# EAGLE design EMGrealPart4 (EAGLE 9.4.0)

## Sheet 1 of 2
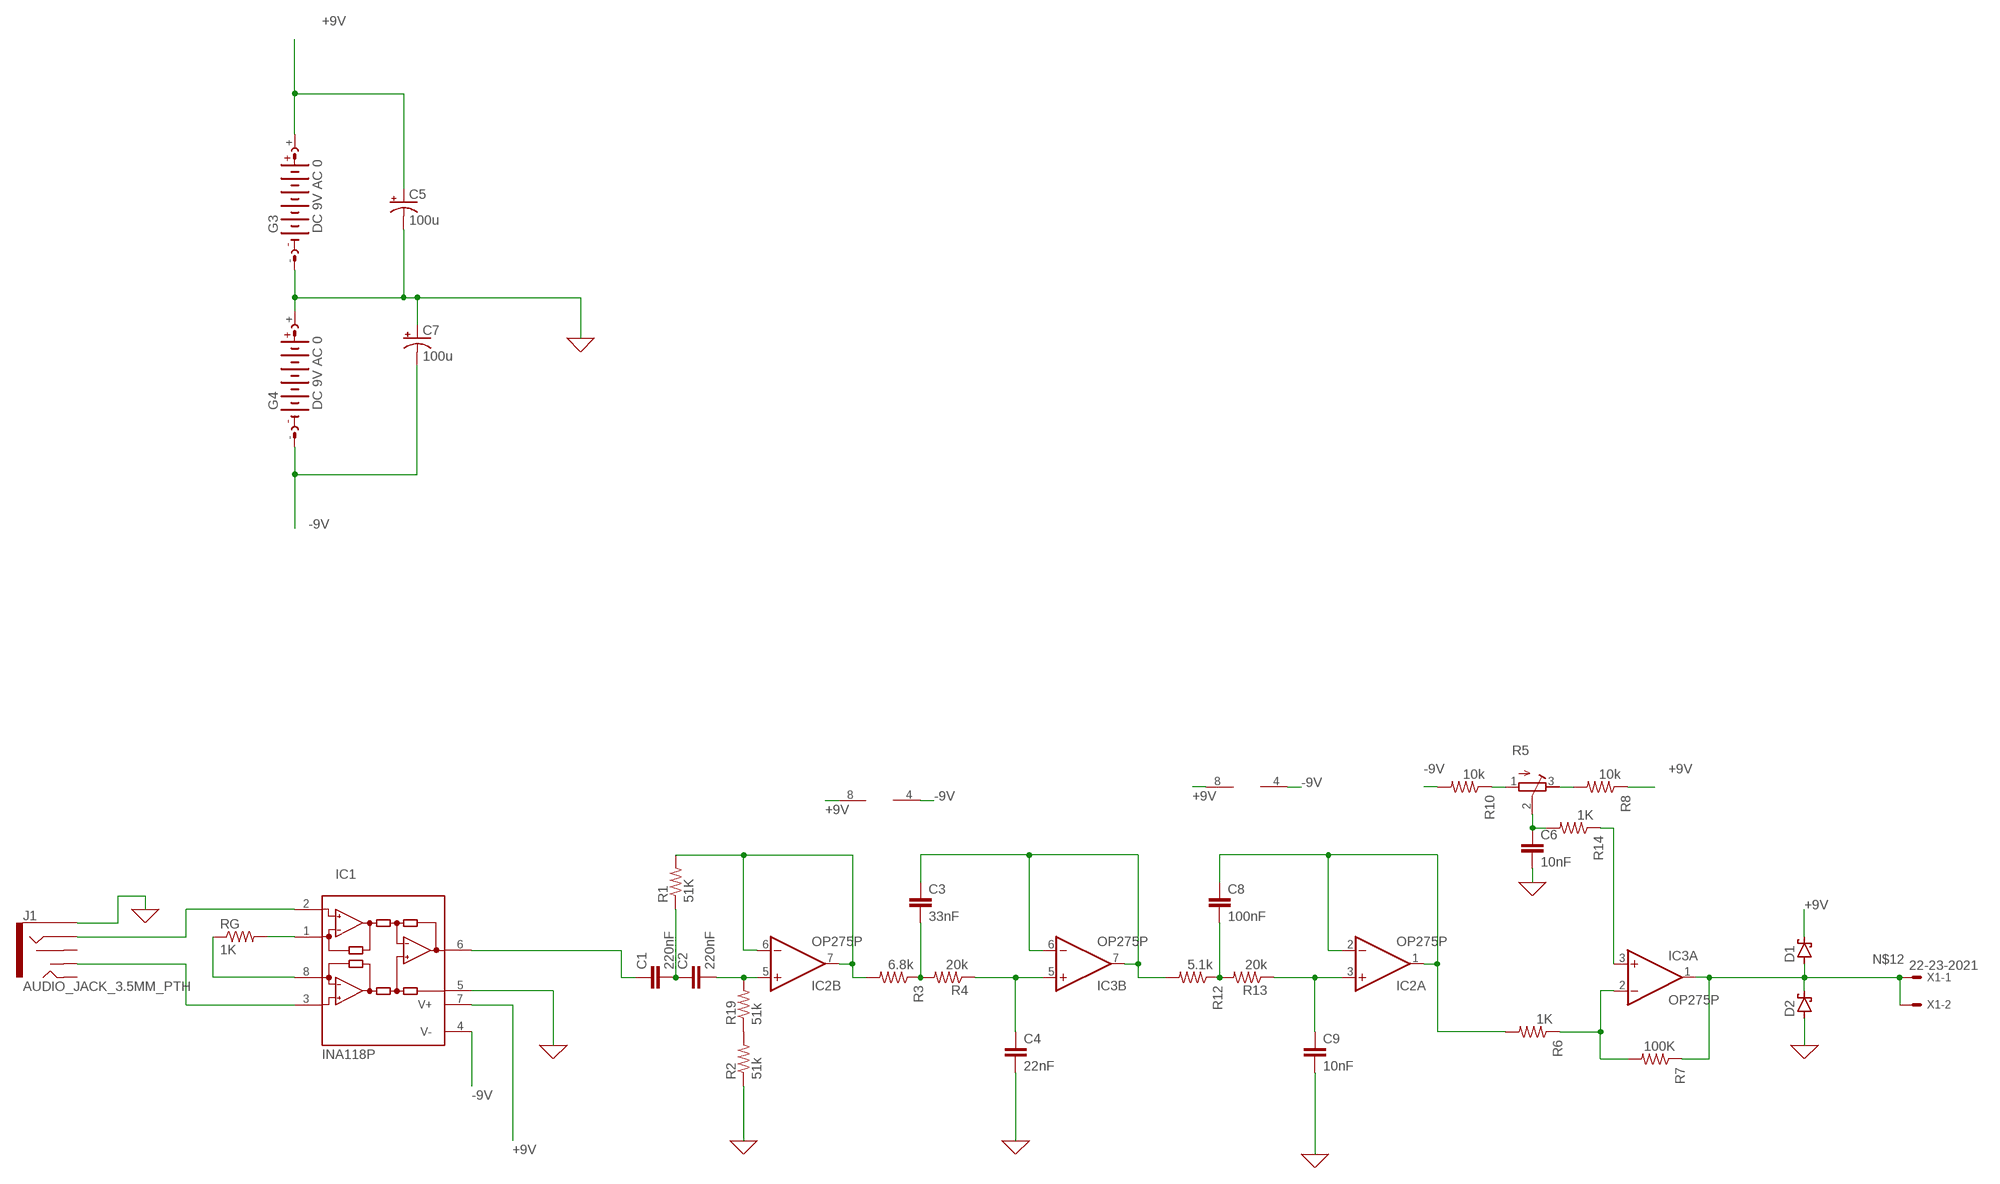
[diagram p0: schematic, sheet 1]

### Parts
C1  220nF  C-EU050-025X075  [C050-025X075]
C2  220nF  C-EU050-025X075  [C050-025X075]
C3  33nF  C-EU050-025X075  [C050-025X075]
C4  22nF  C-EU050-025X075  [C050-025X075]
C5  100u  CPOL-USE2.5-6  [E2,5-6]
C6  10nF  C-EU050-025X075  [C050-025X075]
C7  100u  CPOL-USE2.5-6  [E2,5-6]
C8  100nF  C-EU050-025X075  [C050-025X075]
C9  10nF  C-EU050-025X075  [C050-025X075]
D1  SCHOTTKY-DIODEF126Z12  [F126Z12]
D2  SCHOTTKY-DIODEF126Z12  [F126Z12]
G3  DC 9V AC 0  AB9V  [AB9V]
G4  DC 9V AC 0  AB9V  [AB9V]
IC1  INA118P  [DIL08]
IC2  OP275P  [DIL08]
IC3  OP275P  [DIL08]
J1  AUDIO_JACK_3.5MM_PTH  [AUDIO-JACK]
R1  51K  R-US_0207/12  [0207/12]
R2  51k  R-US_0207/12  [0207/12]
R3  6.8k  R-US_0207/12  [0207/12]
R4  20k  R-US_0207/12  [0207/12]
R5  R-TRIMM64W  [RTRIM64W]
R6  1K  R-US_0207/12  [0207/12]
R7  100K  R-US_0207/12  [0207/12]
R8  10k  R-US_0207/12  [0207/12]
R10  10k  R-US_0207/12  [0207/12]
R12  5.1k  R-US_0207/12  [0207/12]
R13  20k  R-US_0207/12  [0207/12]
R14  1K  R-US_0207/12  [0207/12]
R19  51k  R-US_0207/12  [0207/12]
RG  1K  R-US_0207/12  [0207/12]
X1  22-23-2021  [22-23-2021]

### Nets
0: C4.2 C5.- C6.2 C7.+ C9.2 D2.A G3.- G4.+ IC1.5(REF) J1.SLEEVE R2.1 ; supply symbol labelled GND
+9V: C5.+ D1.C G3.+ IC1.7(V+) IC2.8(P:V+) IC3.8(P:V+) R8.1
-9V: C7.- G4.- IC1.4(V-) IC2.4(P:V-) IC3.4(P:V-) R10.2
N$1: IC1.1(RG) RG.2
N$2: IC1.8(RG) RG.1
N$3: IC1.2(-IN) J1.RING
N$4: C8.2 R12.1 R13.2
N$5: C1.2 C2.1 R1.1
N$6: C1.1 IC1.6(OUT)
N$7: C2.2 IC2.5(B:+IN) R19.2
N$8: IC2.6(B:-IN) IC2.7(B:OUT) R1.2 R3.2
N$9: C3.2 R3.1 R4.2
N$10: C4.1 IC3.5(B:+IN) R4.1
N$11: C3.1 IC3.6(B:-IN) IC3.7(B:OUT) R12.2
N$12: D1.A D2.C IC3.1(A:OUT) R7.1 X1.1 X1.2
N$14: C9.1 IC2.3(A:+IN) R13.1
N$15: R5.1(A) R10.1
N$16: C6.1 R5.2(S) R14.2
N$17: IC3.2(A:-IN) R6.1 R7.2
N$18: R2.2 R19.1
N$19: C8.1 IC2.1(A:OUT) IC2.2(A:-IN) R6.2
N$20: R5.3(E) R8.2
N$25: IC3.3(A:+IN) R14.1
N$26: IC1.3(+IN) J1.TSH
Unconnected: J1.RSH J1.TIP

## Sheet 2 of 2

## Library data of the parts
C1-C4 C6 C8 C9 = rcl:C-EU: CAPACITOR, European symbol; SPICEPREFIX: C
C5 C7 = rcl:CPOL-US: POLARIZED CAPACITOR, American symbol; SPICEPREFIX: C
D1 D2 = diode:SCHOTTKY-DIODE: Schottky Diode
G3 G4 = battery:AB9V: 9-V BATTERY CLIP; SPICEPREFIX: V
IC1 = burr-brown:INA118: Instrumentation Amplifier Precision, Low Power; MF: TEXAS INSTRUMENTS; MPN: INA118P; OC_FARNELL: 1470354; OC_NEWARK: 96K4515; SPICEMODEL: INA118a; SPICEPREFIX: X
IC2 IC3 = linear:OP275: Dual Very Low Noise Precision Operational Amplifier Source: http://www.analog.com/static/imported-files/data_sheets/OP270.pdf; SPICEMODEL: OP275p; SPICEPREFIX: X
J1 = SparkFun-Connectors:AUDIO_JACK_3.5MM: Audio Jack 3.5mm variants of PTH and SMT stereo audio jack with bypass switches. SparkFun Products: SparkFun SparkPunk Sound Kit <[https://www.sparkfun.com/products/11177]> - PTH MP3 Trigger <https://www.sparkfun.com/products/13720> -3.5mm SMD SparkFun PicoBoard <https://www.sparkfun.com/products/11888>- 2.5mm SMD; PROD_ID: CONN-08774; SF_ID: PRT-08032
R1-R4 R6-R8 R10 R12-R14 R19 RG = rcl:R-US_: RESISTOR, American symbol; SPICEPREFIX: R
R5 = rcl:R-TRIMM: Trimm resistor; SPICEMODEL: X; SPICEPREFIXL: POT
X1 = con-molex:22-23-2021: .100" (2.54mm) Center Header - 2 Pin; MF: MOLEX; MPN: 22-23-2021; OC_FARNELL: 1462926; OC_NEWARK: 25C3832

## Module MO
Ports: OUT(io) IN(io)

### Library data of the parts

## Board
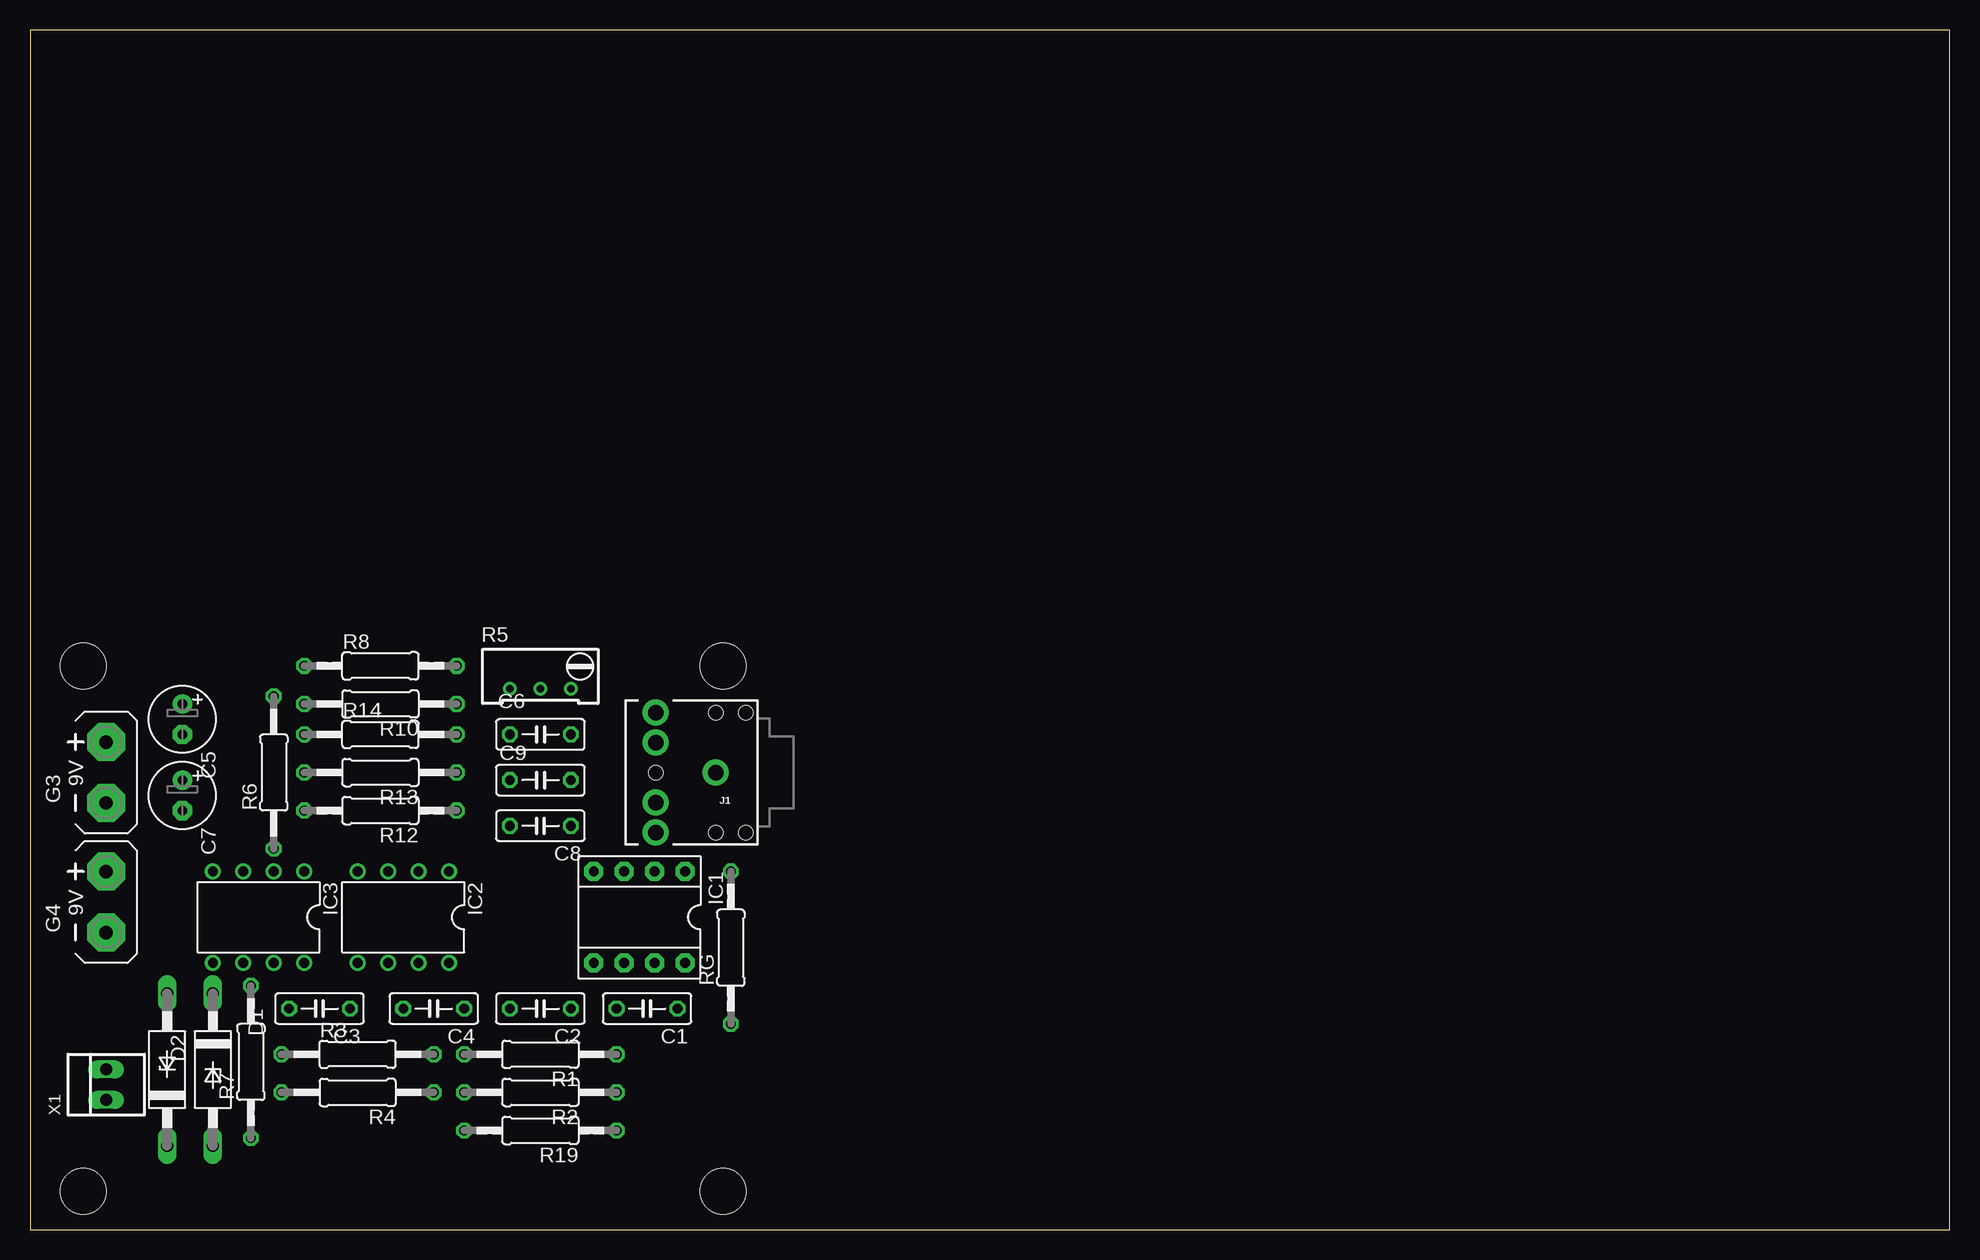
[diagram p1: board, top side]
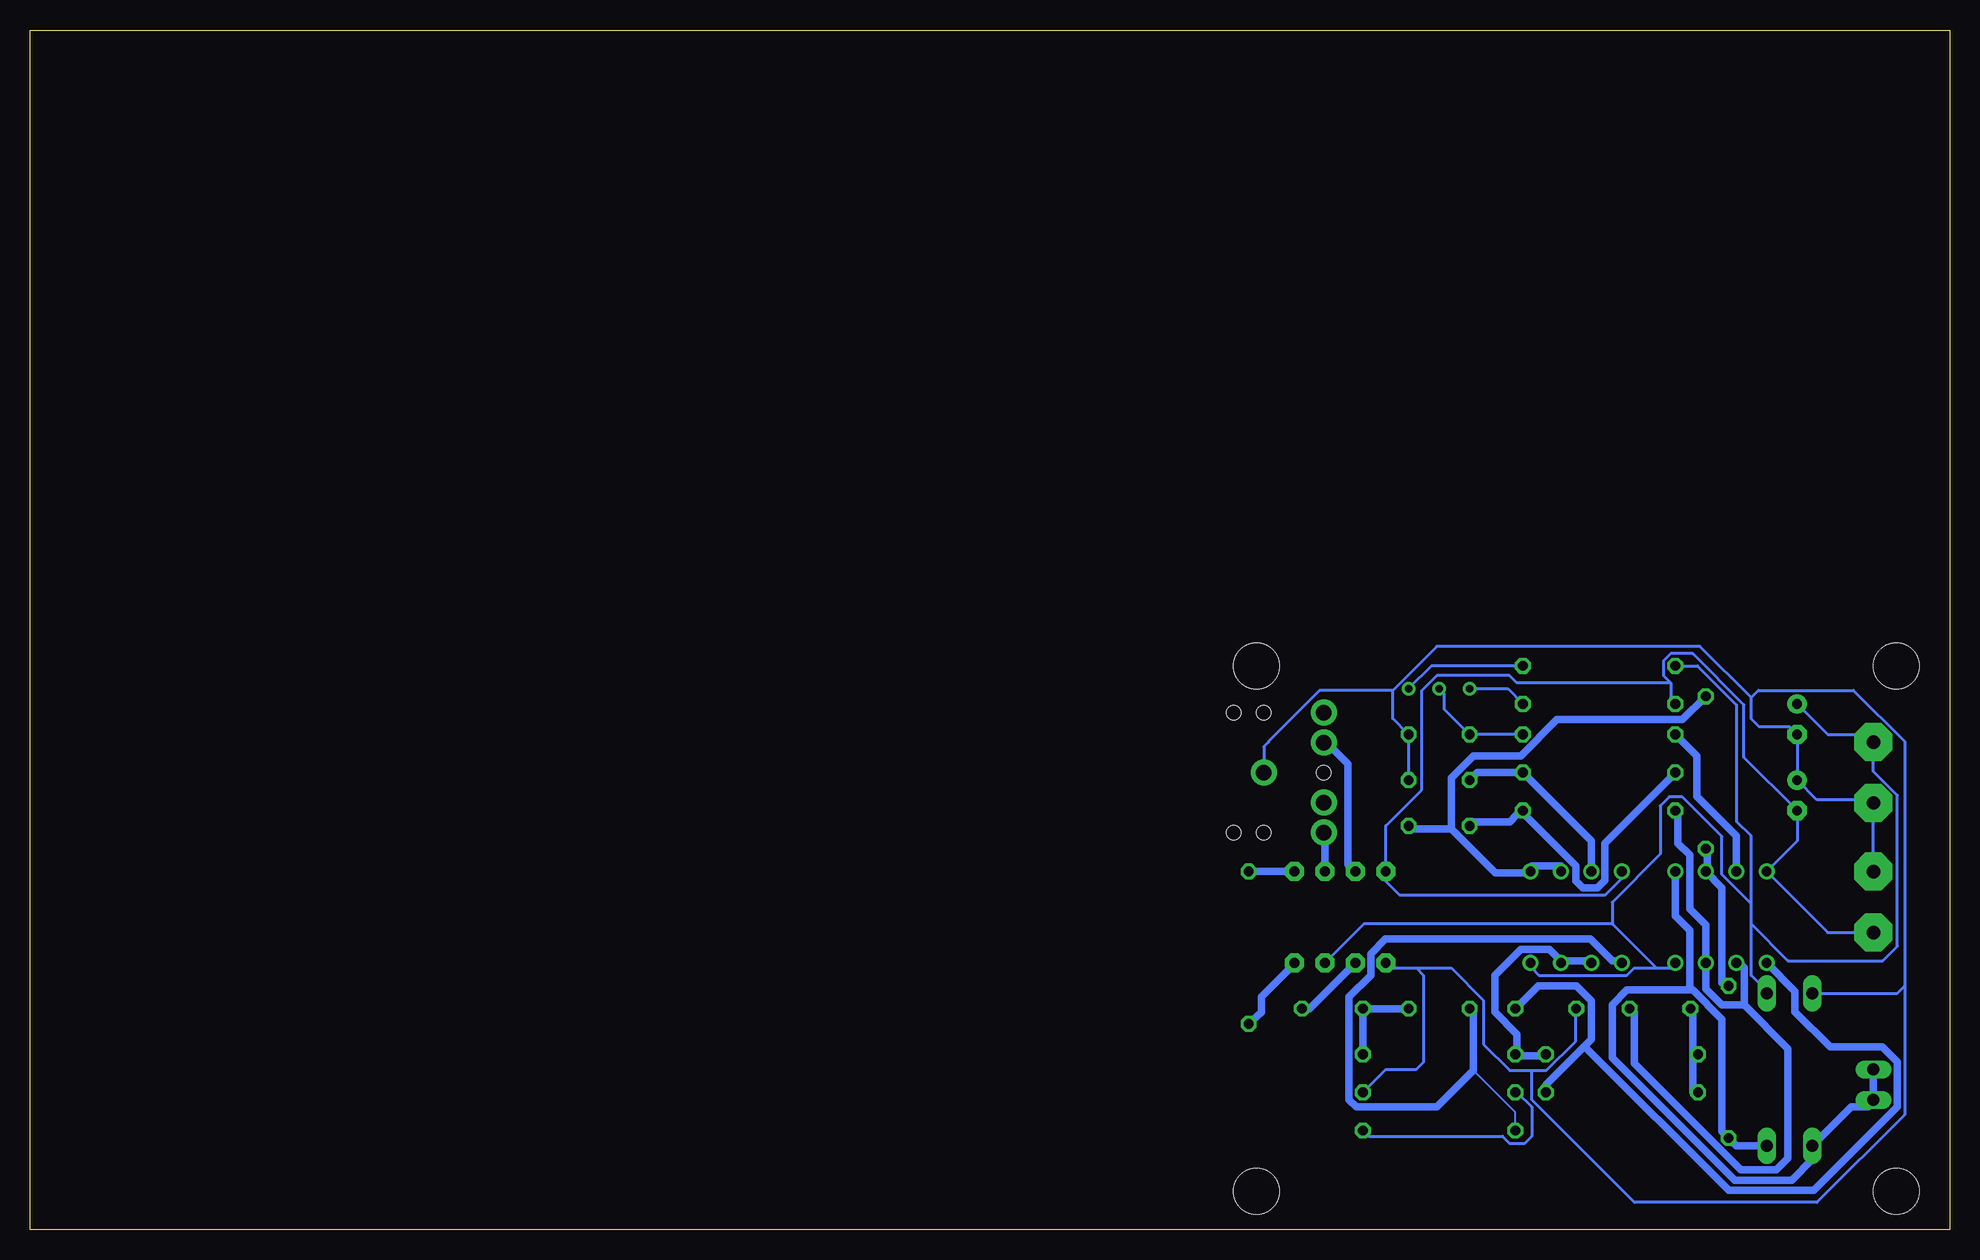
[diagram p2: board, bottom side, seen from below]

Size 160 x 100 mm. Coordinates in mm from the lower left corner, seen from the top.
Outline: 0,0 160,0 160,100 0,100 0,0
Copper layers (1*16): Top 0.035mm / dielectric 1.5mm / Bottom 0.035mm
Design rules "default": minimum track width 6mil, minimum drill 0.35mm, track to track 6mil, track to pad 6mil, pad to pad 6mil, via to via 6mil, smd to smd 6mil, copper to edge 40mil, drill to drill 6mil, minimum pad ring 10mil, minimum via ring 8mil, stop-mask expansion 4mil, vias tented up to drill 0mil, thermal gap 10mil
Holes 3.81 mm at 4.45,46.99 4.45,3.17 57.78,3.17 57.78,46.99

### Footprints (pad centres in the part's own frame; a part is rotated, then mirrored left to right if it is on the bottom)
C050-025X075 = drill 0.813 octagon: 1 -2.54,0; 2 2.54,0
E2,5-6 = drill 0.813 pad 1.6: + -1.27,0 | drill 0.813 pad 1.6 octagon: - 1.27,0
F126Z12 = drill 1.016 long: A 6.35,0; C -6.35,0
AB9V = drill 1.118 pad 3.15 octagon: + 0,2.54; - 0,-2.54
DIL08 = drill 0.813 pad 1.6 octagon: 1 -3.81,-3.81; 2 -1.27,-3.81; 3 1.27,-3.81; 4 3.81,-3.81; 5 3.81,3.81; 6 1.27,3.81; 7 -1.27,3.81; 8 -3.81,3.81
DIL08' = drill 0.813 pad 1.27: 1 -3.81,-3.81; 2 -1.27,-3.81; 3 1.27,-3.81; 4 3.81,-3.81; 5 3.81,3.81; 6 1.27,3.81; 7 -1.27,3.81; 8 -3.81,3.81
AUDIO-JACK = drill 1.3 pad 2.184: RING 5,5; RSH 5,2.5; SLEEVE 0,0; TIP 5,-5; TSH 5,-2.5 | hole 1.2: 0,5; -2.5,5; -2.5,-5; 0,-5; 5,0
0207/12 = drill 0.813 octagon: 1 -6.35,0; 2 6.35,0
RTRIM64W = drill 0.61: 1 1.27,-2.54; 2 1.27,0; 3 1.27,2.54
22-23-2021 = drill 1 long: 1 -1.27,0; 2 1.27,0

### Placement (x,y rotation side)
C1  51.44,18.41 180 top
C2  42.55,18.41 180 top
C3  24.13,18.41 180 top
C4  33.66,18.41 180 top
C5  12.7,42.55 270 top
C6  42.55,41.27 0 top
C7  12.7,36.2 270 top
C8  42.55,33.66 180 top
C9  42.55,37.47 0 top
D1  15.24,13.34 270 top
D2  11.43,13.34 90 top
G3  6.35,38.1 0 top
G4  6.35,27.3 0 top
IC1  50.8,26.04 180 top
IC2  OP275P  [DIL08']  31.11,26.04 180 top
IC3  OP275P  [DIL08']  19.05,26.04 180 top
J1  57.15,38.1 180 top
R1  42.55,14.61 180 top
R2  42.55,11.43 180 top
R3  27.3,14.61 0 top
R4  27.3,11.43 180 top
R5  42.55,46.35 270 top
R6  20.32,38.1 90 top
R7  18.41,13.97 90 top
R8  29.21,46.99 0 top
R10  29.21,43.81 180 top
R12  29.21,34.92 180 top
R13  29.21,38.1 180 top
R14  29.21,41.27 0 top
R19  42.55,8.26 180 top
RG  58.42,23.5 90 top
X1  6.35,12.06 90 top

### Tracks (layer width: path | path; a pad name or v marks a point on that pad's centre or on a via)
0
  Bottom 0.254: 34.82,13.26 36.65,13.26 38.84,15.44 38.84,19.1 41.53,21.79 44.45,21.79 | 34.82,13.26 33.6,13.26 31.17,15.7 31.17,18.14 C4.2 | 44.45,21.79 46.41,21.79 IC1.5 | 16.54,44.35 15.93,44.96 8,44.96 3.73,40.69 3.73,20.32 | 46.41,44.96 42.75,48.62 20.8,48.62 16.54,44.35 | 34.82,13.26 34.82,10.82 26.26,2.26 11.05,2.26 3.73,9.58 3.73,20.32 | R2.1 46.99,13.34 44.45,13.34 43.81,13.97 43.81,21.16 44.45,21.79 | C9.2 C6.2 46.41,42.6 46.41,44.96 | 46.41,44.96 52.5,44.96 56.77,40.69 56.77,40.64 57.15,40.26 J1.SLEEVE | G4.+ G3.- 6.6,35.81 11.05,35.81 C7.+ C5.- 13.34,41.91 15.88,41.91 16.54,42.57 16.54,44.35 | 3.73,20.32 4.37,19.68 D2.A
+9V
  Bottom 0.254: 24.43,21.79 26.29,21.79 26.9,21.18 34.21,21.18 34.82,21.79 IC2.8 | 24.43,21.79 23.24,21.79 IC3.8 | IC1.7 48.82,25.48 28.12,25.48 | 24.43,21.79 28.12,25.48 | 16.54,25.48 16.54,21.18 15.32,19.96 D1.C | 16.54,25.48 16.54,27.15 | 16.54,27.15 16.54,32.82 17.75,34.04 17.75,43.74 21.01,46.99 R8.1 | 16.54,25.48 13.46,22.4 5.56,22.4 4.34,23.62 4.34,36.2 6.35,38.2 G3.+ 6.99,41.27 10.16,41.27 C5.+ | 28.12,25.48 28.12,27.28 24.11,31.29 24.11,35.33 23.37,36.07 22.28,36.07 18.97,32.77 18.97,29.59 16.54,27.15
-9V
  Bottom 0.254: IC2.4 27.3,29.29 28.7,27.89 45.85,27.89 46.99,29.03 IC1.4 46.99,33.66 43.99,36.65 43.99,44.93 42.75,46.18 36.68,46.18 36.07,45.57 23.24,45.57 | 23.24,45.57 23.24,44.35 R10.2 | 23.24,45.57 23.85,46.18 23.85,47.4 23.24,48.01 21.41,48.01 17.14,43.74 17.14,39.37 C7.- 12.7,32.38 IC3.4 10.16,24.77 G4.-
N$1
  Bottom 0.61: IC1.1 RG.2
N$2
  Bottom 0.152: 54.94,21.79 IC1.8
  Bottom 0.61: 54.94,21.79 57.35,19.38 57.35,18.09 RG.1
N$3
  Bottom 0.61: J1.RING 52.07,33.02 IC1.2
N$4
  Bottom 0.152: 35.43,34.59 R12.1
  Bottom 0.61: 35.43,34.59 31.17,30.33 31.17,29.08 30.58,28.5 29.34,28.5 28.73,29.11 28.73,32.21 22.99,37.95 R13.2 | C8.2 39.7,33.98 36.65,33.98 36.04,34.59 R12.1
N$5
  Bottom 0.61: C2.1 C1.2 R1.1
N$6
  Bottom 0.61: IC1.6 53.34,18.41 C1.1
N$7
  Bottom 0.152: 27.51,22.4 IC2.5 | R19.2 36.2,9.75 39.7,13.26
  Bottom 0.61: C2.2 39.7,18.14 39.7,13.26 42.75,10.21 49.45,10.21 50.06,10.82 50.06,19.38 48.25,21.2 48.25,23 47.02,24.23 29.92,24.23 28.09,22.4 27.51,22.4
N$8
  Bottom 0.61: R3.2 34.21,14.48 36.04,14.48 R1.2 36.04,15.09 36.04,16.28 37.9,18.14 37.9,21.18 35.71,23.37 33.35,23.37 32.38,22.4 | 32.38,22.4 29.95,22.4 IC2.6 | 32.38,22.4 IC2.7
N$9
  Bottom 0.61: 21.41,14.48 21.41,11.43 R4.2 | 21.41,14.48 21.41,18.14 C3.2 | 21.41,14.48 R3.1
N$10
  Bottom 0.61: 30.44,15.28 33.6,12.12 33.6,11.43 R4.1 | 30.44,15.28 18.41,3.25 11.3,3.25 4.34,10.21 4.34,13.97 5.59,15.21 9.93,15.21 12.88,18.16 12.88,19.86 IC3.5 | 30.44,15.28 29.84,15.88 29.84,19.05 31.11,20.32 34.29,20.32 C4.1
N$11
  Bottom 0.61: IC3.6 17.53,22.23 17.12,21.82 17.12,18.72 | 17.12,18.72 18.97,18.72 20.32,20.07 IC3.7 20.32,25.4 21.67,26.75 21.67,31.24 22.63,32.21 22.63,34.59 R12.2 | 17.12,18.72 13.46,15.06 13.46,5.94 14.43,4.98 17.4,4.98 26.29,13.87 26.29,18.14 C3.1
N$12
  Bottom 0.61: 21.67,19.96 21.67,24.94 22.86,26.14 IC3.1 | 21.67,19.96 21.41,19.96 18.97,17.53 18.97,8.18 R7.1 17.78,6.99 D1.A | 21.67,19.96 26.9,19.96 28.12,18.75 28.12,14.33 17.91,4.12 13.16,4.12 11.43,5.84 D2.C 8.2,10.21 6.78,10.21 X1.1 X1.2
N$14
  Bottom 0.152: 35.53,38.1 R13.1
  Bottom 0.61: C9.1 39.37,38.1 R13.1 29.84,32.38 IC2.3
N$15
  Bottom 0.254: R5.1 36.83,45.09 R10.1
N$16
  Bottom 0.254: R5.2 42.14,44.68 42.14,43.41 C6.1 R14.2
N$17
  Bottom 0.61: R7.2 18.97,20.57 18.97,28.5 IC3.2 20.19,30.33 20.19,31.55 R6.1
N$18
  Bottom 0.152: 36.04,11.43 R2.2
  Bottom 0.254: 36.04,11.43 34.82,10.21 34.82,7.77 35.43,7.16 36.65,7.16 37.26,7.77 48.41,7.77 R19.1
N$19
  Bottom 0.61: IC2.2 32.38,30.33 34.82,30.33 IC2.1 35.43,29.72 37.87,29.72 41.53,33.38 | 41.53,33.38 44.58,33.38 C8.1 | 41.53,33.38 41.53,37.64 39.67,39.5 35.74,39.5 32.72,42.52 22.25,42.52 R6.2
N$20
  Bottom 0.254: R8.2 43.18,46.99 R5.3
N$25
  Bottom 0.61: IC3.3 17.78,32.82 21.06,36.09 21.06,39.47 R14.1
N$26
  Bottom 0.61: IC1.3 50.06,30.33 50.16,30.43 50.16,38.83 51.93,40.6 J1.TSH